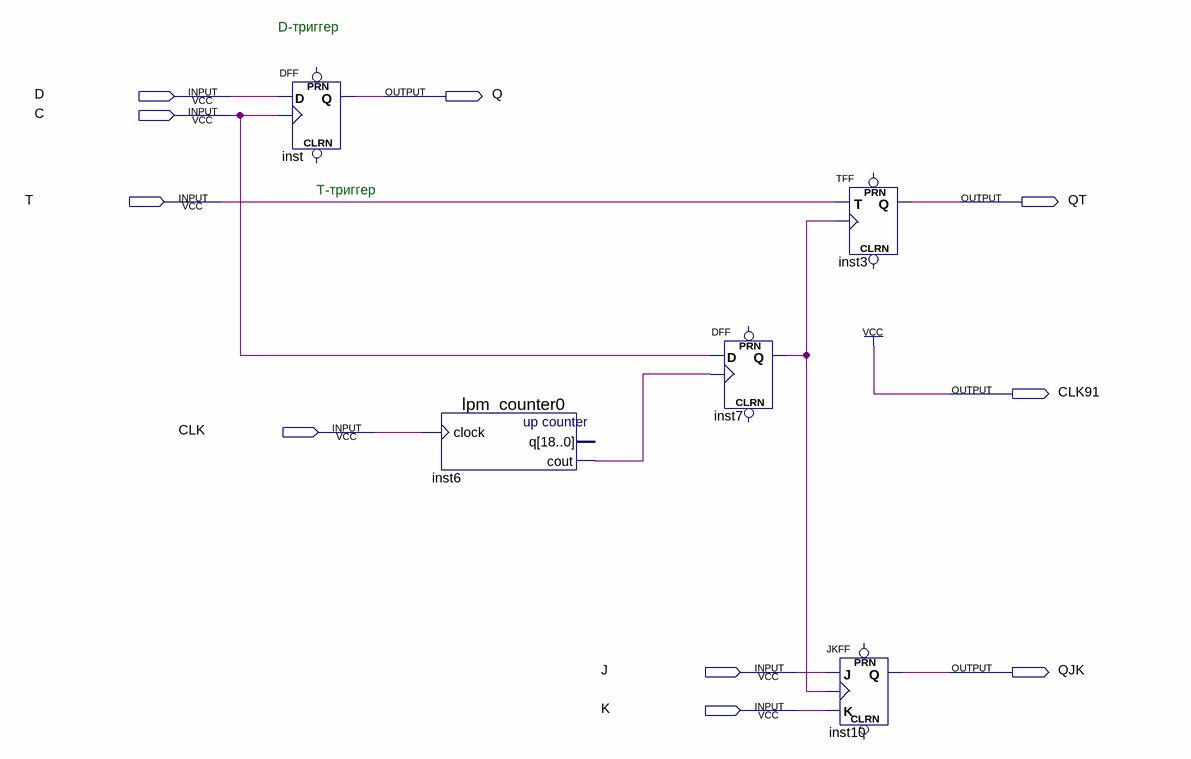
[diagram p0: schematic sheet]
// Quartus schematic D_T_JK-triggers.bdf as structural Verilog: 5 symbols, 10 pins
module \D_T_JK-triggers  (
  input  D,
  input  C,
  input  T,
  input  CLK,
  input  J,
  input  K,
  output Q,
  output QT,
  output CLK91,
  output QJK
);

  wire inst6_cout, inst7_q;

  DFF inst (.CLK(C), .D(D), .Q(Q));  // open: CLRN, PRN
  lpm_counter0 inst6 (.clock(CLK), .cout(inst6_cout));  // open: q
  DFF inst7 (.CLK(inst6_cout), .D(C), .Q(inst7_q));  // open: CLRN, PRN
  TFF inst3 (.T(T), .CLK(inst7_q), .Q(QT));  // open: PRN, CLRN
  JKFF inst10 (.K(K), .J(J), .CLK(inst7_q), .Q(QJK));  // open: PRN, CLRN

  assign CLK91 = 1'b1;

  // Notes on the sheet:
  //   D-триггер
  //   T-триггер
endmodule
